# Altium schematic sheet Atomizer.SchDoc
size A1
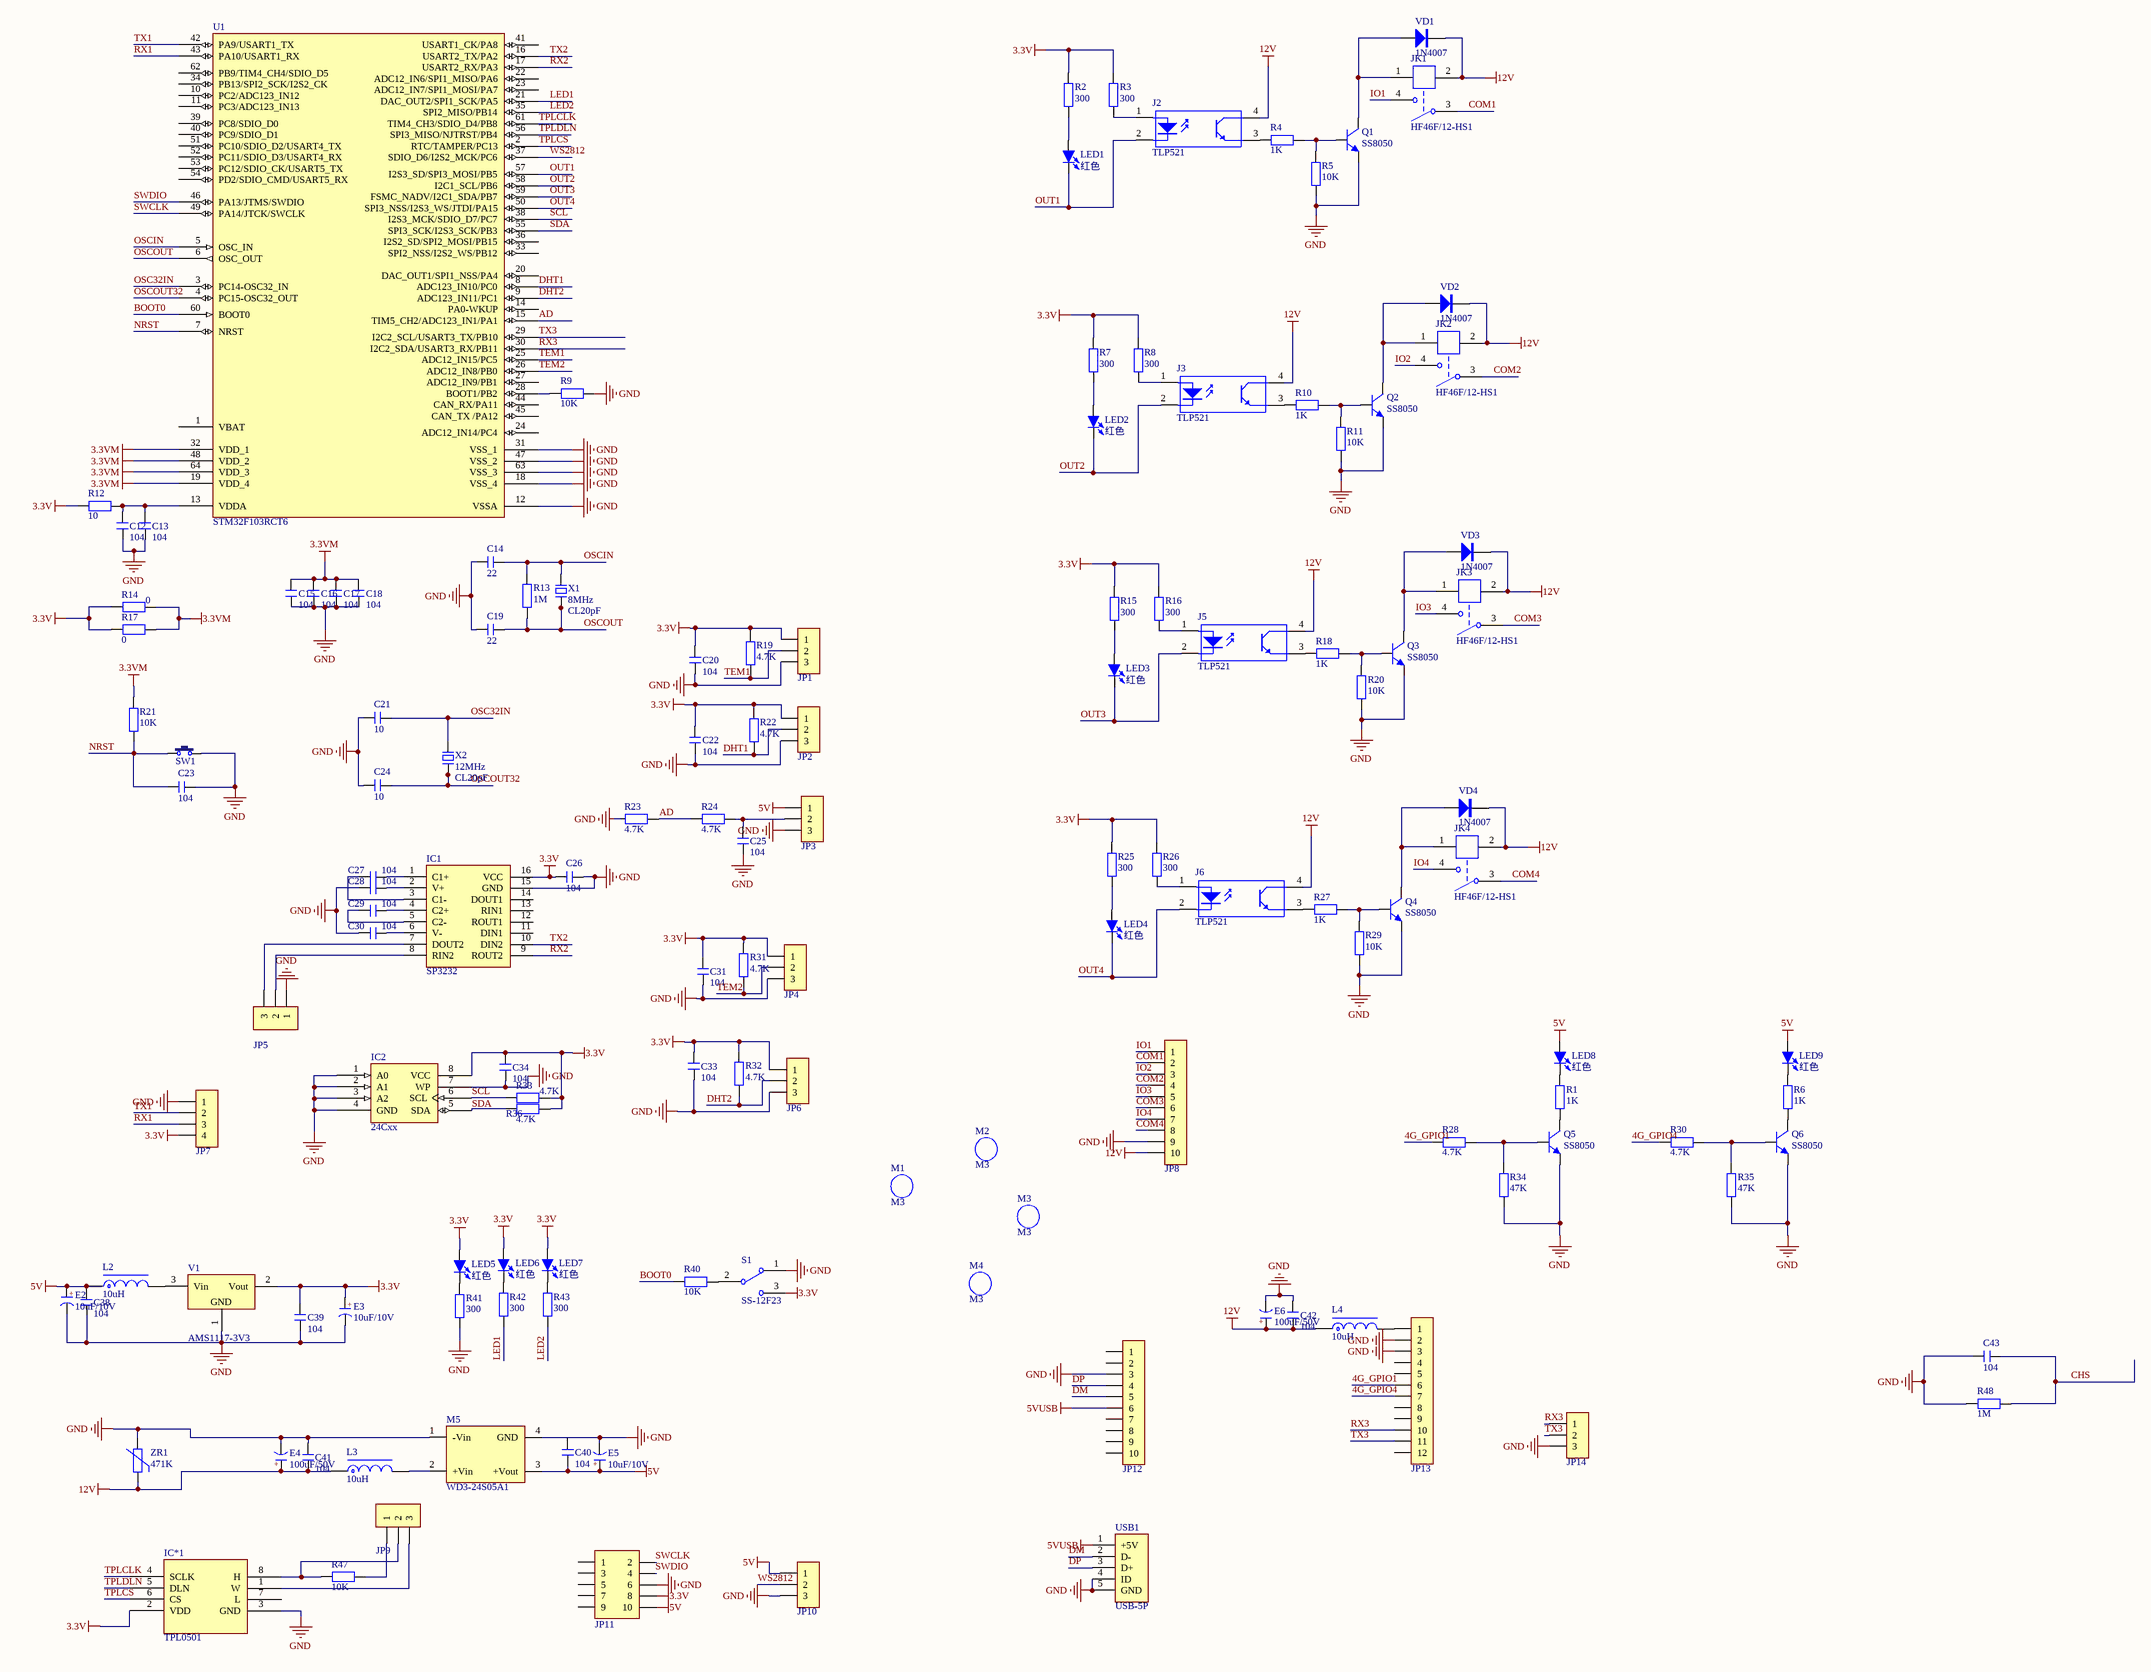
[diagram p0: Atomizer.SchDoc]

## Parts
C12  104  [C 0805_M]
C13  104  [C 0805_M]
C14  22  [C 0805_M]
C15  104  [C 0805_M]
C16  104  [C 0805_M]
C17  104  [C 0805_M]
C18  104  [C 0805_M]
C19  22  [C 0805_M]
C20  104  [C 0805_M]
C21  10  [C 0805_M]
C22  104  [C 0805_M]
C23  104  [C 0805_M]
C24  10  [C 0805_M]
C25  104  [C 0805_M]
C26  104  [C 0805_M]
C27  104  [C 0805_M]
C28  104  [C 0805_M]
C29  104  [C 0805_M]
C30  104  [C 0805_M]
C31  104  [C 0805_M]
C33  104  [C 0805_M]
C34  104  [C 0805_M]
C38  104  [C 0805_M]
C39  104  [C 0805_M]
C40  104  [C 0805_M]
C41  104  [C 0805_M]
C42  104  [C 0805_M]
C43  104  [C 1206_L]
E2  10uF/10V  [CT 5*6 - C]
E3  10uF/10V  [CM C(5*5.4)]
E4  100uF/50V  [CT 10*8 - C]
E5  10uF/10V  [CT 5*6 - C]
E6  100uF/50V  [CT 10*8 - C]
IC1  SP3232  [TSSOP-16]
IC2  24Cxx  [SOP8_L]
IC*1  TPL0501  [SOT23-8L]
J2  TLP521  [DIP4-300]
J3  TLP521  [DIP4-300]
J5  TLP521  [DIP4-300]
J6  TLP521  [DIP4-300]
JK1  HF46F/12-HS1  [HF46-xx-HS1]
JK2  HF46F/12-HS1  [HF46-xx-HS1]
JK3  HF46F/12-HS1  [HF46-xx-HS1]
JK4  HF46F/12-HS1  [HF46-xx-HS1]
JP1  HDR-1X3  [KF128-3.81-3P]  (value not drawn)
JP2  HDR-1X3  [KF128-3.81-3P]  (value not drawn)
JP3  HDR-1X3  [KF128-3.81-3P]  (value not drawn)
JP4  HDR-1X3  [KF128-3.81-3P]  (value not drawn)
JP5  HDR-1X3  [XH2.54-LI-3P]  (value not drawn)
JP6  HDR-1X3  [KF128-3.81-3P]  (value not drawn)
JP7  HDR-1X4  [HDR2.54-LI-4P]  (value not drawn)
JP8  HDR-1X10  [KF128-5.08-10P]  (value not drawn)
JP9  HDR-1X3  [KF128-3.81-3P]  (value not drawn)
JP10  HDR-1X3  [KF128-3.81-3P]  (value not drawn)
JP11  Header 5X2  [IDC2.54-LI-2x5P]  (value not drawn)
JP12  HDR-1X10  [HDR2.54-M-LI-10P]  (value not drawn)
JP13  HDR-1X12  [HDR2.54-M-LI-12P]  (value not drawn)
JP14  HDR-1X3  [HDR2.54-LI-3P]  (value not drawn)
L2  10uH  [CD32]
L3  10uH  [CD32]
L4  10uH  [CD32]
LED1  红色  [0805_LED_S1]
LED2  红色  [0805_LED_S1]
LED3  红色  [0805_LED_S1]
LED4  红色  [0805_LED_S1]
LED5  红色  [0805_LED_S1]
LED6  红色  [0805_LED_S1]
LED7  红色  [0805_LED_S1]
LED8  红色  [0805_LED_S1]
LED9  红色  [0805_LED_S1]
M1  M3  [M3 125X200]
M2  M3  [M3 125X200]
M3  M3  [M3 125X200]
M4  M3  [M3 125X200]
M5  WD3-24S05A1  [WD-24S05A1]
Q1  SS8050  [SOT23-3N]
Q2  SS8050  [SOT23-3N]
Q3  SS8050  [SOT23-3N]
Q4  SS8050  [SOT23-3N]
Q5  SS8050  [SOT23-3N]
Q6  SS8050  [SOT23-3N]
R1  1K  [R 0805_M]
R2  300  [R 0805_M]
R3  300  [R 0805_M]
R4  1K  [R 0805_M]
R5  10K  [R 0805_M]
R6  1K  [R 0805_M]
R7  300  [R 0805_M]
R8  300  [R 0805_M]
R9  10K  [R 0805_M]
R10  1K  [R 0805_M]
R11  10K  [R 0805_M]
R12  10  [R 0805_M]
R13  1M  [R 0805_M]
R14  0  [R 0805_M]
R15  300  [R 0805_M]
R16  300  [R 0805_M]
R17  0  [R 0805_M]
R18  1K  [R 0805_M]
R19  4.7K  [R 0805_M]
R20  10K  [R 0805_M]
R21  10K  [R 0805_M]
R22  4.7K  [R 0805_M]
R23  4.7K  [R 0805_M]
R24  4.7K  [R 0805_M]
R25  300  [R 0805_M]
R26  300  [R 0805_M]
R27  1K  [R 0805_M]
R28  4.7K  [R 0805_M]
R29  10K  [R 0805_M]
R30  4.7K  [R 0805_M]
R31  4.7K  [R 0805_M]
R32  4.7K  [R 0805_M]
R33  4.7K  [R 0805_M]
R34  47K  [R 0805_M]
R35  47K  [R 0805_M]
R36  4.7K  [R 0805_M]
R40  10K  [R 0805_M]
R41  300  [R 0805_M]
R42  300  [R 0805_M]
R43  300  [R 0805_M]
R47  10K  [R 0805_M]
R48  1M  [R 1206_L]
S1  SS-12F23  [MSK-12C01-07]
SW1  3x6x5  [TSW SMD-3*6*2.5]  (value not drawn)
U1  STM32F103RCT6  [LQFP64 10X10_N]
USB1  USB-5P  [USB-MICRO_A]
V1  AMS1117-3V3  [SOT223_L]
VD1  1N4007  [SMA(DO-214AC)_S1]
VD2  1N4007  [SMA(DO-214AC)_S1]
VD3  1N4007  [SMA(DO-214AC)_S1]
VD4  1N4007  [SMA(DO-214AC)_S1]
X1  8MHz  负载电容: CL20pF  [SMD-5032_2P]
X2  12MHz  负载电容: CL20pF  [OSC-3x10-LI]
ZR1  471K  [VDR 9D-4.5]

## Nets
3.3V: C20.2 C22.2 C26.1 C31.2 C33.2 C34.2 C39.2 E3.1(A) IC1.16(VCC) IC2.8(VCC) IC*1.2(VDD) JP1.1 JP2.1 JP4.1 JP6.1 JP7.4 JP11.8 LED5.1(A) LED6.1(A) LED7.1(A) R2.2 R3.2 R7.2 R8.2 R12.1 R14.1 R15.2 R16.2 R17.1 R19.2 R22.2 R25.2 R26.2 R31.2 R32.2 R33.2 R36.2 S1.3 V1.2(Vout)
3.3VM: C15.2 C16.2 C17.2 C18.2 R14.2 R17.2 R21.2 U1.19(VDD_4) U1.32(VDD_1) U1.48(VDD_2) U1.64(VDD_3)
5V: C40.1 E2.1(A) E5.1(A) JP3.1 JP10.1 JP11.10 L2.1 LED8.1(A) LED9.1(A) M5.3(+Vout)
5VUSB: JP12.6 USB1.1(+5V)
12V: C41.1 C42.1 E4.1(A) E6.1(A) J2.4(C) J3.4(C) J5.4(C) J6.4(C) JK1.2 JK2.2 JK3.2 JK4.2 JP8.10 L3.1 L4.1 VD1.2(K) VD2.2(K) VD3.2(K) VD4.2(K) ZR1.1
GND: C12.1 C13.1 C14.2 C15.1 C16.1 C17.1 C18.1 C19.2 C20.1 C21.2 C22.1 C23.2 C24.2 C25.1 C26.2 C28.1 C30.1 C31.1 C33.1 C34.1 C38.1 C39.1 C41.2 C42.2 C43.1 E2.2(K) E3.2(K) E4.2(K) E5.2(K) E6.2(K) IC1.15(GND) IC2.1(A0) IC2.2(A1) IC2.3(A2) IC2.4(GND) IC2.7(WP) IC*1.3(GND) JP1.3 JP2.3 JP3.3 JP4.3 JP5.1 JP6.3 JP7.1 JP8.9 JP10.3 JP11.6 JP12.3 JP13.2 JP13.3 JP14.3 M5.1(-Vin) M5.4(GND) Q1.2(E) Q2.2(E) Q3.2(E) Q4.2(E) Q5.2(E) Q6.2(E) R5.1 R9.2 R11.1 R20.1 R23.1 R29.1 R34.1 R35.1 R41.1 R48.1 S1.1 SW1.2 U1.12(VSSA) U1.18(VSS_4) U1.31(VSS_1) U1.47(VSS_2) U1.63(VSS_3) USB1.4(ID) USB1.5(GND) V1.1(GND) ZR1.2
4G_GPIO1: JP13.6 R28.2
4G_GPIO4: JP13.7 R30.2
AD: R23.2 R24.1 U1.15(TIM5_CH2/ADC123_IN1/PA1)
BOOT0: R40.1 U1.60(BOOT0)
CHS: C43.2 R48.2
COM1: JK1.3 JP8.2
COM2: JK2.3 JP8.4
COM3: JK3.3 JP8.6
COM4: JK4.3 JP8.8
DHT1: JP2.2 R22.1 U1.8(ADC123_IN10/PC0)
DHT2: JP6.2 R32.1 U1.9(ADC123_IN11/PC1)
DM: JP12.5 USB1.2(D-)
DP: JP12.4 USB1.3(D+)
IO1: JK1.4 JP8.1
IO2: JK2.4 JP8.3
IO3: JK3.4 JP8.5
IO4: JK4.4 JP8.7
LED1: R42.1 U1.21(DAC_OUT2/SPI1_SCK/PA5)
LED2: R43.1 U1.35(SPI2_MISO/PB14)
NRST: C23.1 R21.1 SW1.1 U1.7(NRST)
OSC32IN: C21.1 U1.3(PC14-OSC32_IN) X2.2
OSCIN: C14.1 R13.2 U1.5(OSC_IN) X1.2
OSCOUT: C19.1 R13.1 U1.6(OSC_OUT) X1.1
OSCOUT32: C24.1 U1.4(PC15-OSC32_OUT) X2.1
OUT1: J2.2(K) LED1.2(K) U1.57(I2S3_SD/SPI3_MOSI/PB5)
OUT2: J3.2(K) LED2.2(K) U1.58(I2C1_SCL/PB6)
OUT3: J5.2(K) LED3.2(K) U1.59(FSMC_NADV/I2C1_SDA/PB7)
OUT4: J6.2(K) LED4.2(K) U1.50(SPI3_NSS/I2S3_WS/JTDI/PA15)
RX1: JP7.3 U1.43(PA10/USART1_RX)
RX2: IC1.9(ROUT2) U1.17(USART2_RX/PA3)
RX3: JP13.10 JP14.1 U1.30(I2C2_SDA/USART3_RX/PB11)
SCL: IC2.6(SCL) R33.1 U1.38(I2S3_MCK/SDIO_D7/PC7)
SDA: IC2.5(SDA) R36.1 U1.55(SPI3_SCK/I2S3_SCK/PB3)
SWCLK: JP11.2 U1.49(PA14/JTCK/SWCLK)
SWDIO: JP11.4 U1.46(PA13/JTMS/SWDIO)
TEM1: JP1.2 R19.1 U1.25(ADC12_IN15/PC5)
TEM2: JP4.2 R31.1 U1.26(ADC12_IN8/PB0)
TPLCLK: IC*1.4(SCLK) U1.61(TIM4_CH3/SDIO_D4/PB8)
TPLCS: IC*1.6(CS) U1.2(RTC/TAMPER/PC13)
TPLDLN: IC*1.5(DLN) U1.56(SPI3_MISO/NJTRST/PB4)
TX1: JP7.2 U1.42(PA9/USART1_TX)
TX2: IC1.10(DIN2) U1.16(USART2_TX/PA2)
TX3: JP13.11 JP14.2 U1.29(I2C2_SCL/USART3_TX/PB10)
WS2812: JP10.2 U1.37(SDIO_D6/I2S2_MCK/PC6)
NetC12_2: C12.2 C13.2 R12.2 U1.13(VDDA)
NetC25_2: C25.2 JP3.2 R24.2
NetC27_1: C27.1 IC1.3(C1-)
NetC27_2: C27.2 IC1.1(C1+)
NetC28_2: C28.2 IC1.2(V+)
NetC29_1: C29.1 IC1.5(C2-)
NetC29_2: C29.2 IC1.4(C2+)
NetC30_2: C30.2 IC1.6(V-)
NetIC1_7: IC1.7(DOUT2) JP5.3
NetIC1_8: IC1.8(RIN2) JP5.2
NetIC*1_1: IC*1.1(W) JP9.3
NetIC*1_8: IC*1.8(H) JP9.2 R47.1
NetJ2_1: J2.1(A) R3.1
NetJ2_3: J2.3(E) R4.1
NetJ3_1: J3.1(A) R8.1
NetJ3_3: J3.3(E) R10.1
NetJ5_1: J5.1(A) R16.1
NetJ5_3: J5.3(E) R18.1
NetJ6_1: J6.1(A) R26.1
NetJ6_3: J6.3(E) R27.1
NetJK1_1: JK1.1 Q1.3(C) VD1.1(A)
NetJK2_1: JK2.1 Q2.3(C) VD2.1(A)
NetJK3_1: JK3.1 Q3.3(C) VD3.1(A)
NetJK4_1: JK4.1 Q4.3(C) VD4.1(A)
NetJP9_1: JP9.1 R47.2
NetJP13_1: JP13.1 L4.2
NetL2_2: L2.2 V1.3(Vin)
NetL3_2: L3.2 M5.2(+Vin)
NetLED1_1: LED1.1(A) R2.1
NetLED2_1: LED2.1(A) R7.1
NetLED3_1: LED3.1(A) R15.1
NetLED4_1: LED4.1(A) R25.1
NetLED5_2: LED5.2(K) R41.2
NetLED6_2: LED6.2(K) R42.2
NetLED7_2: LED7.2(K) R43.2
NetLED8_2: LED8.2(K) R1.2
NetLED9_2: LED9.2(K) R6.2
NetQ1_1: Q1.1(B) R4.2 R5.2
NetQ2_1: Q2.1(B) R10.2 R11.2
NetQ3_1: Q3.1(B) R18.2 R20.2
NetQ4_1: Q4.1(B) R27.2 R29.2
NetQ5_1: Q5.1(B) R28.1 R34.2
NetQ5_3: Q5.3(C) R1.1
NetQ6_1: Q6.1(B) R30.1 R35.2
NetQ6_3: Q6.3(C) R6.1
NetR9_1: R9.1 U1.28(BOOT1/PB2)
NetR40_2: R40.2 S1.2

Not connected (* = marked no-connect by the designer): C38 2; C40 2; IC1 11(DIN1) 12(ROUT1) 13(RIN1) 14(DOUT1); IC*1 7(L); JP11 1 3 5 7 9; JP12 1 2 7 8 9 10; JP13 4 5 8 9 12; U1 1(VBAT) 10(PC2/ADC123_IN12) 11(PC3/ADC123_IN13) 14(PA0-WKUP) 20(DAC_OUT1/SPI1_NSS/PA4) 22(ADC12_IN6/SPI1_MISO/PA6) 23(ADC12_IN7/SPI1_MOSI/PA7) 24(ADC12_IN14/PC4) 27(ADC12_IN9/PB1) 33(SPI2_NSS/I2S2_WS/PB12) 34(PB13/SPI2_SCK/I2S2_CK) 36(I2S2_SD/SPI2_MOSI/PB15) 39(PC8/SDIO_D0) 40(PC9/SDIO_D1) 41(USART1_CK/PA8) 44(CAN_RX/PA11) 45(CAN_TX_/PA12) 51(PC10/SDIO_D2/USART4_TX) 52(PC11/SDIO_D3/USART4_RX) 53(PC12/SDIO_CK/USART5_TX) 54(PD2/SDIO_CMD/USART5_RX) 62(PB9/TIM4_CH4/SDIO_D5)

## Notes on the sheet
- (in symbol C-CM) +
- (in symbol C-CT) +

## Library data of the parts
C12-C31 C33 C34 C38-C42 = C: 无极性贴片电容; 版权归属: 源创客; BOM名称: 无极性贴片电容; 学习资源: www.ooocke.com
C43 = C: 无极性贴片电容; 版权归属: 源创客; 材质: X7R; BOM名称: 无极性贴片电容; 学习资源: www.ooocke.com
E2 E4-E6 = C-CT: 贴片固态电容; 版权归属: 源创客; BOM名称: 贴片固态电容; 学习资源: www.ooocke.com
E3 = C-CM: 贴片电解电容; 版权归属: 源创客; BOM名称: 贴片电解电容; 学习资源: www.ooocke.com
IC1 = SP3232: RS232通讯芯片; 版权归属: 源创客; BOM名称: RS232通讯芯片; 学习资源: www.ooocke.com
IC2 = 24Cxx: 外置EEPROM; 版权归属: 源创客; BOM名称: 外置EEPROM; 学习资源: www.ooocke.com
IC*1 = TPL0501: 数字电位器
J2 J3 J5 J6 = TLP521: 开关光耦; 版权归属: 源创客; BOM名称: 开关光耦; 学习资源: www.ooocke.com
JK1-JK4 = HF46F/12-HS1: 12V一组常开; BOM名称: 12V继电器; 版权归属: 源创客; 学习资源: www.ooocke.com
JP1-JP6 JP9 JP10 JP14 = Header 3: 3P接插件; 版权归属: 源创客; BOM名称: 3P接插件; 学习资源: www.ooocke.com
JP7 = Header 4: 4P接插件; 版权归属: 源创客; BOM名称: 4P接插件; 学习资源: www.ooocke.com
JP8 JP12 = Header 10: 10P接插件; 版权归属: 源创客; BOM名称: 10P接插件; 学习资源: www.ooocke.com
JP11 = Header 5X2: 5*2P接插件; 版权归属: 源创客; BOM名称: 5*2P接插件; 学习资源: www.ooocke.com
JP13 = Header 12: 12P接插件; 版权归属: 源创客; BOM名称: 12P接插件; 学习资源: www.ooocke.com
L2-L4 = L-CD: 贴片功率电感; BOM名称: 功率电感; 版权归属: 源创客; 学习资源: www.ooocke.com
LED1-LED9 = LED-SMD: 贴片LED; 版权归属: 源创客; BOM名称: 贴片LED; 学习资源: www.ooocke.com
M1-M4 = M3: 铜柱孔; 版权归属: 源创客; BOM名称: 铜柱孔; 学习资源: www.ooocke.com
M5 = WD3-24S05A1: 24V转5V模块; 版权归属: 源创客; BOM名称: 24V转5V模块; 学习资源: www.ooocke.com
Q1-Q6 = 8050-SMD: 高频放大-NPN型; 版权归属: 源创客; 属性: 40V 1.5A 1W 100MHZ; 学习资源: www.ooocke.com
  Q1-Q4 Q6: BOM名称: 高频放大-NPN型
  Q5: BOM名称: SS8050
R1-R36 R40-R43 R47 R48 = R: 贴片电阻; 版权归属: 源创客; BOM名称: 贴片电阻; 学习资源: www.ooocke.com
S1 = SSW-1P: 1路波动开关; BOM名称: 波动开关; 版权归属: 源创客; 学习资源: www.ooocke.com
SW1 = TSW 3x6: 3x6轻触开关; 版权归属: 源创客; BOM名称: 3x6轻触开关; 学习资源: www.ooocke.com
U1 = STM32F103RE: 32位STM单片机; 版权归属: 源创客; BOM名称: 32位STM单片机; 学习资源: www.ooocke.com
USB1 = USB-5P: 微型USB母座; 版权归属: 源创客; BOM名称: 微型USB母座; 学习资源: www.ooocke.com
V1 = AMS1117: 三端稳压芯片; BOM名称: 稳压芯片; 版权归属: 源创客; 学习资源: www.ooocke.com
VD1 VD2 = 1N4007: 整流二极管; BOM名称: 1N4148WS; 版权归属: 源创客; 学习资源: www.ooocke.com
VD3 VD4 = 1N4007: 整流二极管; 版权归属: 源创客; BOM名称: 整流二极管; 学习资源: www.ooocke.com
X1 = XTAL-2P: 2脚无源脚晶振; BOM名称: SMD_5032_2P; 版权归属: 源创客; 学习资源: www.ooocke.com
X2 = XTAL-2P: 2脚无源脚晶振; 版权归属: 源创客; BOM名称: 2脚无源脚晶振; 学习资源: www.ooocke.com
ZR1 = R_VDR: 压敏电阻; 版权归属: 源创客; BOM名称: 压敏电阻; 学习资源: www.ooocke.com